# EAGLE schematic memoryboard3 (EAGLE 7.3.0)
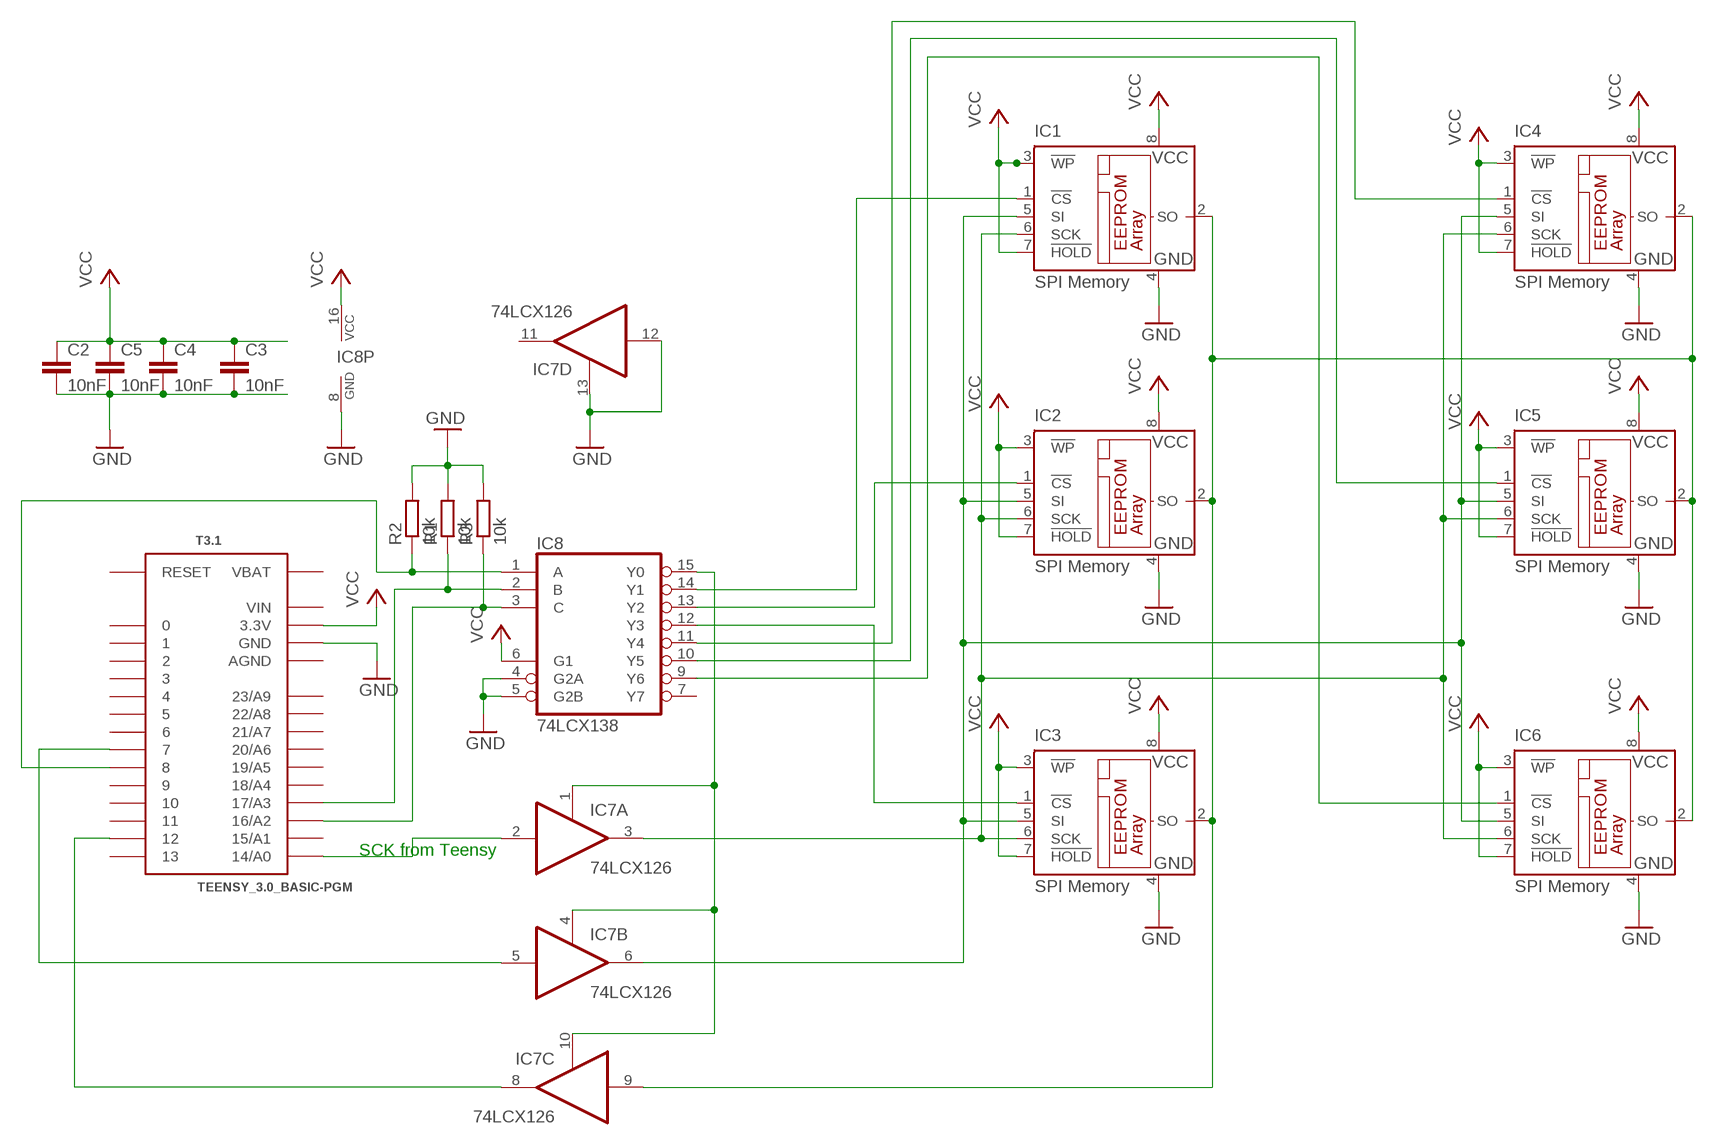
[diagram p0: schematic, sheet 1]

## Parts
C2  10nF  C-EUC0603  [C0603]
C3  10nF  C-EUC0603  [C0603]
C4  10nF  C-EUC0603  [C0603]
C5  10nF  C-EUC0603  [C0603]
IC1  SPI Memory  25C080SN  [SO-08]
IC2  SPI Memory  25C080SN  [SO-08]
IC3  SPI Memory  25C080SN  [SO-08]
IC4  SPI Memory  25C080SN  [SO-08]
IC5  SPI Memory  25C080SN  [SO-08]
IC6  SPI Memory  25C080SN  [SO-08]
IC7  74LCX126  74AC126D  [SO14]
IC8  74LCX138  74HC138D  [SO16]
R1  10k  R-EU_R0603  [R0603]
R2  10k  R-EU_R0603  [R0603]
R3  10k  R-EU_R0603  [R0603]
T3.1  TEENSY_3.0_BASIC-PGM  [TEENSY_3.0_BASIC-PGM]

## Nets
CS0: IC8.1(A) R2.1 T3.1.8
GND: C2.2 C3.2 C4.2 C5.2 IC1.4(GND) IC2.4(GND) IC3.4(GND) IC4.4(GND) IC5.4(GND) IC6.4(GND) IC7.12(D:I) IC7.13(D:OE) IC8.4(G2A) IC8.5(G2B) IC8.8(GND) R1.2 R2.2 R3.2 T3.1.GND T3.1.GND1(GND)
N$6: IC8.3(C) R3.1 T3.1.16/A2
N$9: IC5.1(!CS) IC8.10(Y5)
N$11: IC8.2(B) R1.1 T3.1.17/A3
N$12: IC6.1(!CS) IC8.9(Y6)
N$13: IC3.1(!CS) IC8.12(Y3)
N$15: IC4.1(!CS) IC8.11(Y4)
N$29: IC1.1(!CS) IC8.14(Y1)
N$30: IC2.1(!CS) IC8.13(Y2)
SCK: IC1.6(SCK) IC2.6(SCK) IC3.6(SCK) IC4.6(SCK) IC5.6(SCK) IC6.6(SCK) IC7.3(A:O)
SCK_T: IC7.2(A:I) T3.1.14/A0
SI: IC1.5(SI) IC2.5(SI) IC3.5(SI) IC4.5(SI) IC5.5(SI) IC6.5(SI) IC7.6(B:O)
SI_T: IC7.5(B:I) T3.1.7
SO: IC1.2(SO) IC2.2(SO) IC3.2(SO) IC4.2(SO) IC5.2(SO) IC6.2(SO) IC7.9(C:I)
SO_T: IC7.8(C:O) T3.1.12
SPI_ENABLE: IC7.1(A:OE) IC7.4(B:OE) IC7.10(C:OE) IC8.15(Y0)
VCC: C2.1 C3.1 C4.1 C5.1 IC1.3(!WP) IC1.7(!HOLD) IC1.8(VCC) IC2.3(!WP) IC2.7(!HOLD) IC2.8(VCC) IC3.3(!WP) IC3.7(!HOLD) IC3.8(VCC) IC4.3(!WP) IC4.7(!HOLD) IC4.8(VCC) IC5.3(!WP) IC5.7(!HOLD) IC5.8(VCC) IC6.3(!WP) IC6.7(!HOLD) IC6.8(VCC) IC8.6(G1) IC8.16(VCC) T3.1.3.3V T3.1.3.3V1(3.3V)
Unconnected: IC7.11(D:O) IC8.7(Y7) T3.1.0 T3.1.1 T3.1.2 T3.1.3 T3.1.4 T3.1.5 T3.1.6 T3.1.9 T3.1.10 T3.1.11 T3.1.13 T3.1.15/A1 T3.1.18/A4 T3.1.19/A5 T3.1.20/A6 T3.1.21/A7 T3.1.22/A8 T3.1.23/A9 T3.1.RESET

## Notes on the sheet
- SCK from Teensy

## Power pins joined to a net without a drawn wire
AGND: T3.1.AGND
GND: IC7.7(P:GND)
VBAT: T3.1.VBAT
VCC: IC7.14(P:VCC)
VIN: T3.1.VIN

## Library data of the parts
C2-C5 = resistor:C-EU: CAPACITOR, European symbol
IC1-IC6 = microchip:25*: Serial EEPROM 4K/ 8K , SPI bus; MF: MICROCHIP; MPN: 25C080/SN; OC_FARNELL: unknown; OC_NEWARK: 96K4086
IC7 = 74xx-eu:74*126: Quad bus BUFFER, 3-state
IC8 = 74xx-eu:74*138: 3-line to 8-line DECODER/DEMULTIPLEXER
R1-R3 = resistor:R-EU_: RESISTOR, European symbol
T3.1 = Teensy3.0:TEENSY_3.0_BASIC-PGM: Teensy 3.0 Board outline identical to other 'basic' version except that 'PGM' pin has been omitted. See '+4', 'AllAnalogPins", and 'AllPins' packages for additional pin holes, as needed.